# EAGLE schematic AD9833_FG_Main (EAGLE 7.2.0)
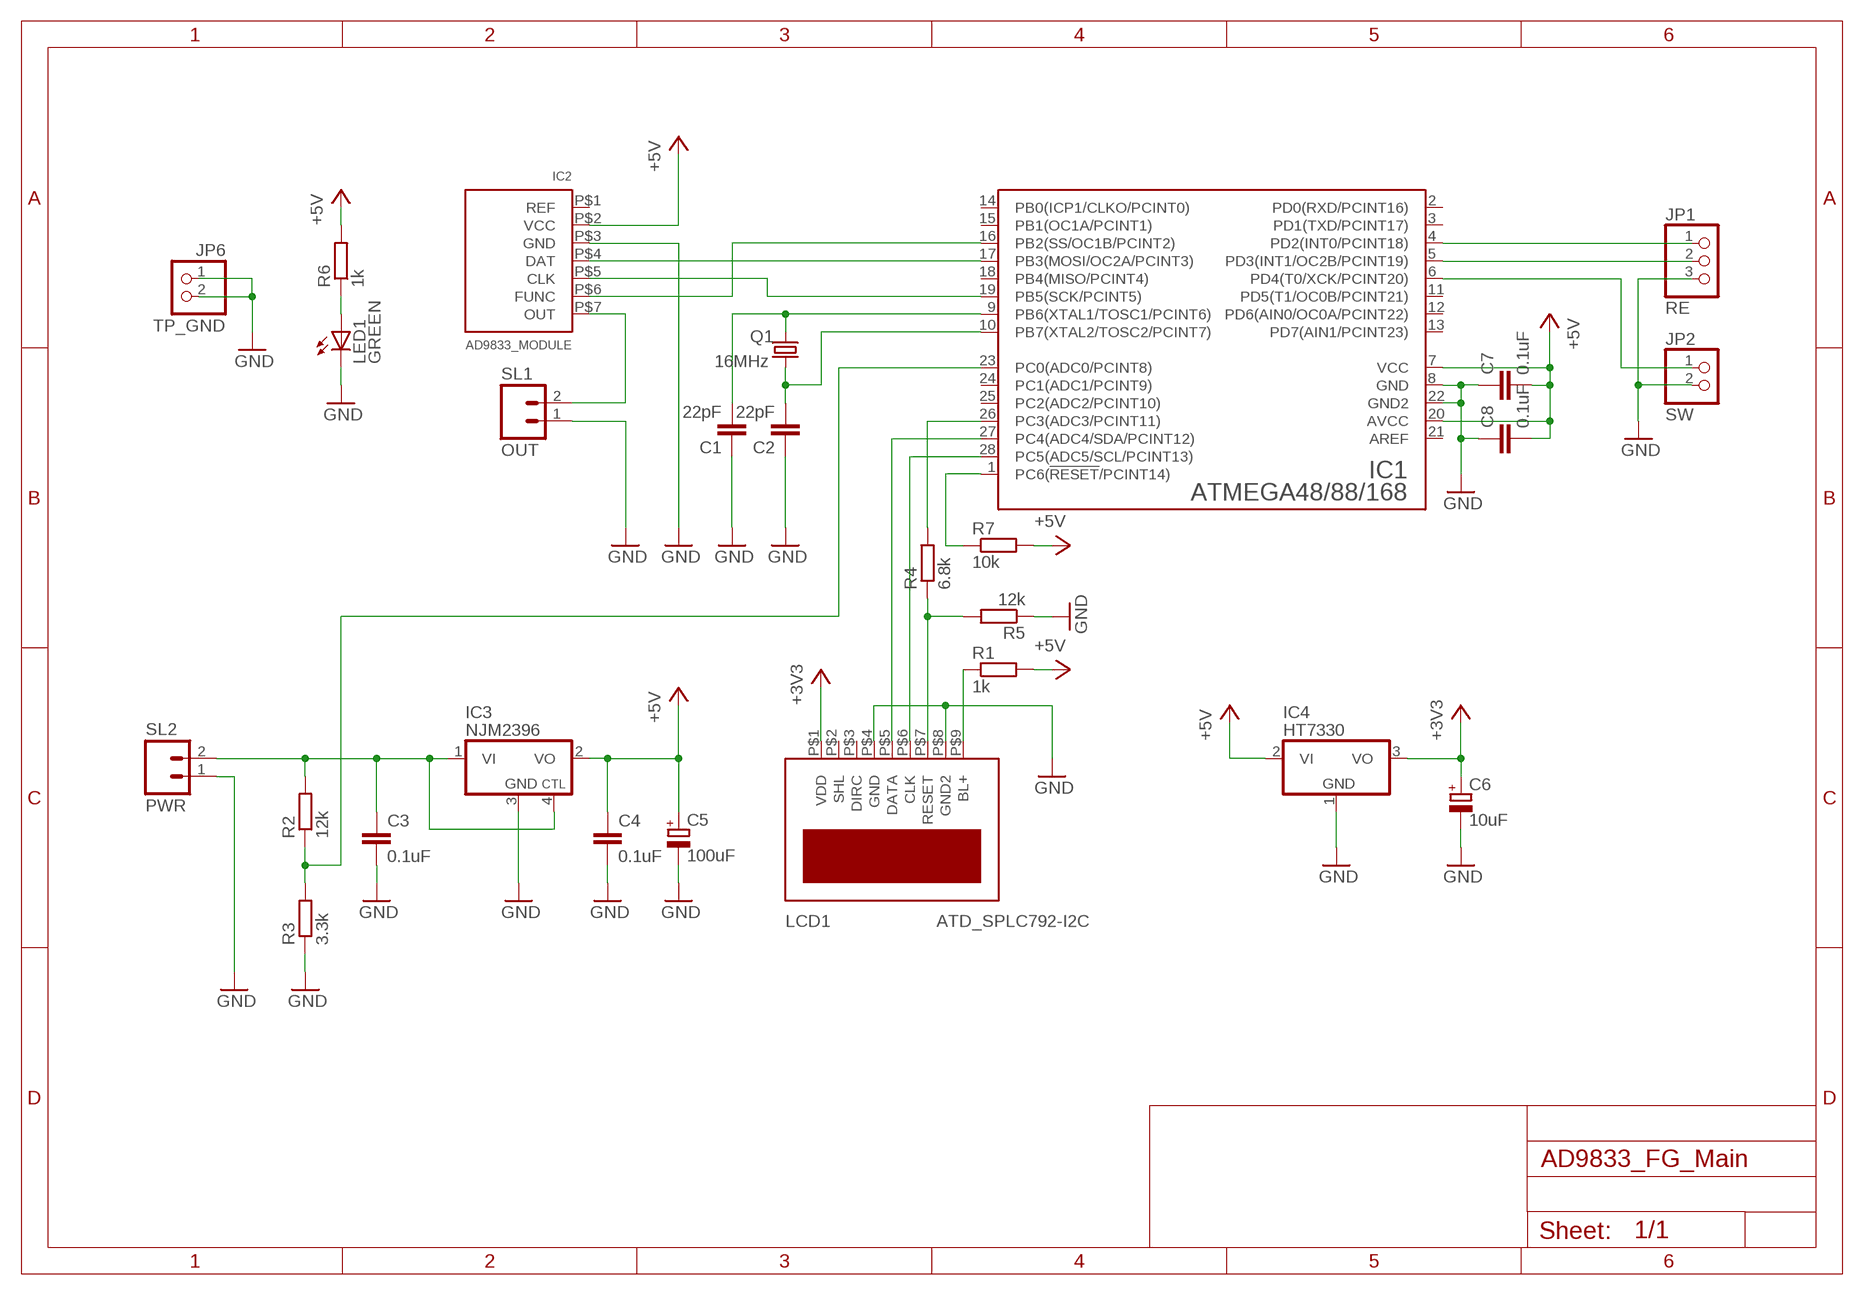
[diagram p0: schematic, sheet 1]

## Parts
C1  22pF  C-EU050-024X044  [C050-024X044]
C2  22pF  C-EU050-024X044  [C050-024X044]
C3  0.1uF  C-EU025-024X044  [C025-024X044]
C4  0.1uF  C-EU025-024X044  [C025-024X044]
C5  100uF  CPOL-EUSANYO_C  [SANYO-OSCON_C]
C6  10uF  CPOL-EUE2.5-6  [E2,5-6]
C7  0.1uF  C-EU025-024X044  [C025-024X044]
C8  0.1uF  C-EU025-024X044  [C025-024X044]
IC1  ATMEGA48/88/168  [DIL28-3]
IC2  AD9833_MODULE  [AD9833_MODULE]
IC3  NJM2396  [TO220-4H]
IC4  HT7330  LP2950-INLINE  [TO226AA]
JP1  RE  PINHD-1X3  [1X03]
JP2  SW  PINHD-1X2  [1X02]
JP6  TP_GND  PINHD-1X2  [1X02]
LCD1  ATD_SPLC792-I2C  [ATD_SPLC792-I2C]
LED1  GREEN  LED3MM  [LED3MM]
Q1  16MHz  CRYSTALHC49S  [HC49/S]
R1  1k  R-EU_0207/7  [0207/7]
R2  12k  R-EU_0207/7  [0207/7]
R3  3.3k  R-EU_0207/7  [0207/7]
R4  6.8k  R-EU_0207/7  [0207/7]
R5  12k  R-EU_0207/7  [0207/7]
R6  1k  R-EU_0207/7  [0207/7]
R7  10k  R-EU_0207/7  [0207/7]
SL1  OUT  M02  [02P]
SL2  PWR  M02  [02P]

## Nets
+3V3: C6.+ IC4.3(VO) LCD1.P$1(VDD)
+5V: C4.1 C5.+ C7.2 C8.2 IC1.7(VCC) IC1.20(AVCC) IC2.P$2(VCC) IC3.2(VO) IC4.2(VI) R1.2 R6.2 R7.2
GND: C1.1 C2.1 C3.2 C4.2 C5.- C6.- C7.1 C8.1 IC1.8(GND) IC1.22(GND2) IC2.P$3(GND) IC3.3(GND) IC4.1(GND) JP1.3 JP2.2 JP6.1 JP6.2 LCD1.P$4(GND) LCD1.P$8(GND2) LED1.K(C) R3.1 R5.1
N$1: IC1.17(PB3(MOSI/OC2A/PCINT3)) IC2.P$4(DAT)
N$2: IC1.19(PB5(SCK/PCINT5)) IC2.P$5(CLK)
N$3: IC1.16(PB2(SS/OC1B/PCINT2)) IC2.P$6(FUNC)
N$4: IC1.28(PC5(ADC5/SCL/PCINT13)) LCD1.P$6(CLK)
N$5: IC1.27(PC4(ADC4/SDA/PCINT12)) LCD1.P$5(DATA)
N$6: IC2.P$7(OUT) SL1.2
N$7: IC1.26(PC3(ADC3/PCINT11)) R4.2
N$8: IC1.4(PD2(INT0/PCINT18)) JP1.1
N$9: IC1.5(PD3(INT1/OC2B/PCINT19)) JP1.2
N$10: IC1.6(PD4(T0/XCK/PCINT20)) JP2.1
N$11: C1.2 IC1.9(PB6(XTAL1/TOSC1/PCINT6)) Q1.1
N$12: C2.2 IC1.10(PB7(XTAL2/TOSC2/PCINT7)) Q1.2
N$13: LCD1.P$7(RESET) R4.1 R5.2
N$14: LCD1.P$9(BL+) R1.1
N$15: C3.1 IC3.1(VI) IC3.4(CTL) R2.2 SL2.2
N$16: IC1.23(PC0(ADC0/PCINT8)) R2.1 R3.2
N$17: LED1.A R6.1
N$18: IC1.1(PC6(!RESET!/PCINT14)) R7.1
Unconnected: IC1.2(PD0(RXD/PCINT16)) IC1.3(PD1(TXD/PCINT17)) IC1.11(PD5(T1/OC0B/PCINT21)) IC1.12(PD6(AIN0/OC0A/PCINT22)) IC1.13(PD7(AIN1/PCINT23)) IC1.14(PB0(ICP1/CLKO/PCINT0)) IC1.15(PB1(OC1A/PCINT1)) IC1.18(PB4(MISO/PCINT4)) IC1.21(AREF) IC1.24(PC1(ADC1/PCINT9)) IC1.25(PC2(ADC2/PCINT10)) IC2.P$1(REF) LCD1.P$2(SHL) LCD1.P$3(DIRC) SL1.1 SL2.1

## Library data of the parts
C1-C4 C7 C8 = rcl:C-EU: CAPACITOR, European symbol
C5 C6 = rcl:CPOL-EU: POLARIZED CAPACITOR, European symbol
IC1 = mylib2:ATMEGA48/88/168
IC2 = mylib2:AD9833_MODULE: AD9833 DDS Module
IC3 = mylib2:NJM2396: ON/OFF機能付き低飽和型シリーズレギュレータ
IC4 = mylib2:LP2950-INLINE: 3.3V LDO TO-92
JP1 = pinhead:PINHD-1X3: PIN HEADER
JP2 JP6 = pinhead:PINHD-1X2: PIN HEADER
LCD1 = mylib2:ATD_SPLC792-I2C: aitendo I2C LCD SPLC792-I2C
LED1 = led:LED: LED OSRAM: - CHIPLED LG R971, LG N971, LY N971, LG Q971, LY Q971, LO R971, LY R971 LH N974, LH R974 LS Q976, LO Q976, LY Q976 LO Q996 - Hyper CHIPLED LW Q18S LB Q993, LB Q99A, LB R99A - SideLED LS A670, LO A670, LY A670, LG A670, LP A670 LB A673, LV A673, LT A673, LW A673 LH A674 LY A675 LS A676, LA A676, LO A676, LY A676, LW A676 LS A679, LY A679, LG A679 - Hyper Micro SIDELED® LS Y876, LA Y876, LO Y876, LY Y876 LT Y87S - SmartLED LW L88C, LW L88S LB L89C, LB L89S, LG L890 LS L89K, LO L89K, LY L89K LS L896, LA L896, LO L896, LY L896 - TOPLED LS T670, LO T670, LY T670, LG T670, LP T670 LSG T670, LSP T670, LSY T670, LOP T670, LYG T670 LG T671, LOG T671, LSG T671 LB T673, LV T673, LT T673, LW T673 LH T674 LS T676, LA T676, LO T676, LY T676, LB T676, LH T676, LSB T676, LW T676 LB T67C, LV T67C, LT T67C, LS T67K, LO T67K, LY T67K, LW E67C LS E67B, LA E67B, LO E67B, LY E67B, LB E67C, LV E67C, LT E67C LW T67C LS T679, LY T679, LG T679 LS T770, LO T770, LY T770, LG T770, LP T770 LB T773, LV T773, LT T773, LW T773 LH T774 LS E675, LA E675, LY E675, LS T675 LS T776, LA T776, LO T776, LY T776, LB T776 LHGB T686 LT T68C, LB T68C - Hyper Mini TOPLED® LB M676 - Mini TOPLED Santana® LG M470 LS M47K, LO M47K, LY M47K Source: http://www.osram.convergy.de LUXEON: - LUMILED® LXK2-PW12-R00, LXK2-PW12-S00, LXK2-PW14-U00, LXK2-PW14-V00 LXK2-PM12-R00, LXK2-PM12-S00, LXK2-PM14-U00 LXK2-PE12-Q00, LXK2-PE12-R00, LXK2-PE12-S00, LXK2-PE14-T00, LXK2-PE14-U00 LXK2-PB12-K00, LXK2-PB12-L00, LXK2-PB12-M00, LXK2-PB14-N00, LXK2-PB14-P00, LXK2-PB14-Q00 LXK2-PR12-L00, LXK2-PR12-M00, LXK2-PR14-Q00, LXK2-PR14-R00 LXK2-PD12-Q00, LXK2-PD12-R00, LXK2-PD12-S00 LXK2-PH12-R00, LXK2-PH12-S00 LXK2-PL12-P00, LXK2-PL12-Q00, LXK2-PL12-R00 Source: www.luxeon.com KINGBRIGHT: KA-3528ASYC Source: www.kingbright.com
Q1 = crystal:CRYSTAL: CRYSTAL; OC_FARNELL: 1667008; OC_NEWARK: unknown
R1-R7 = rcl:R-EU_: RESISTOR, European symbol
SL1 SL2 = con-amp-quick:M02: AMP QUICK CONNECTOR; OC_FARNELL: unknown; OC_NEWARK: unknown